# Altium schematic sheet MCU.SchDoc
size A4; SheetNumber: 4; SheetTotal: 4
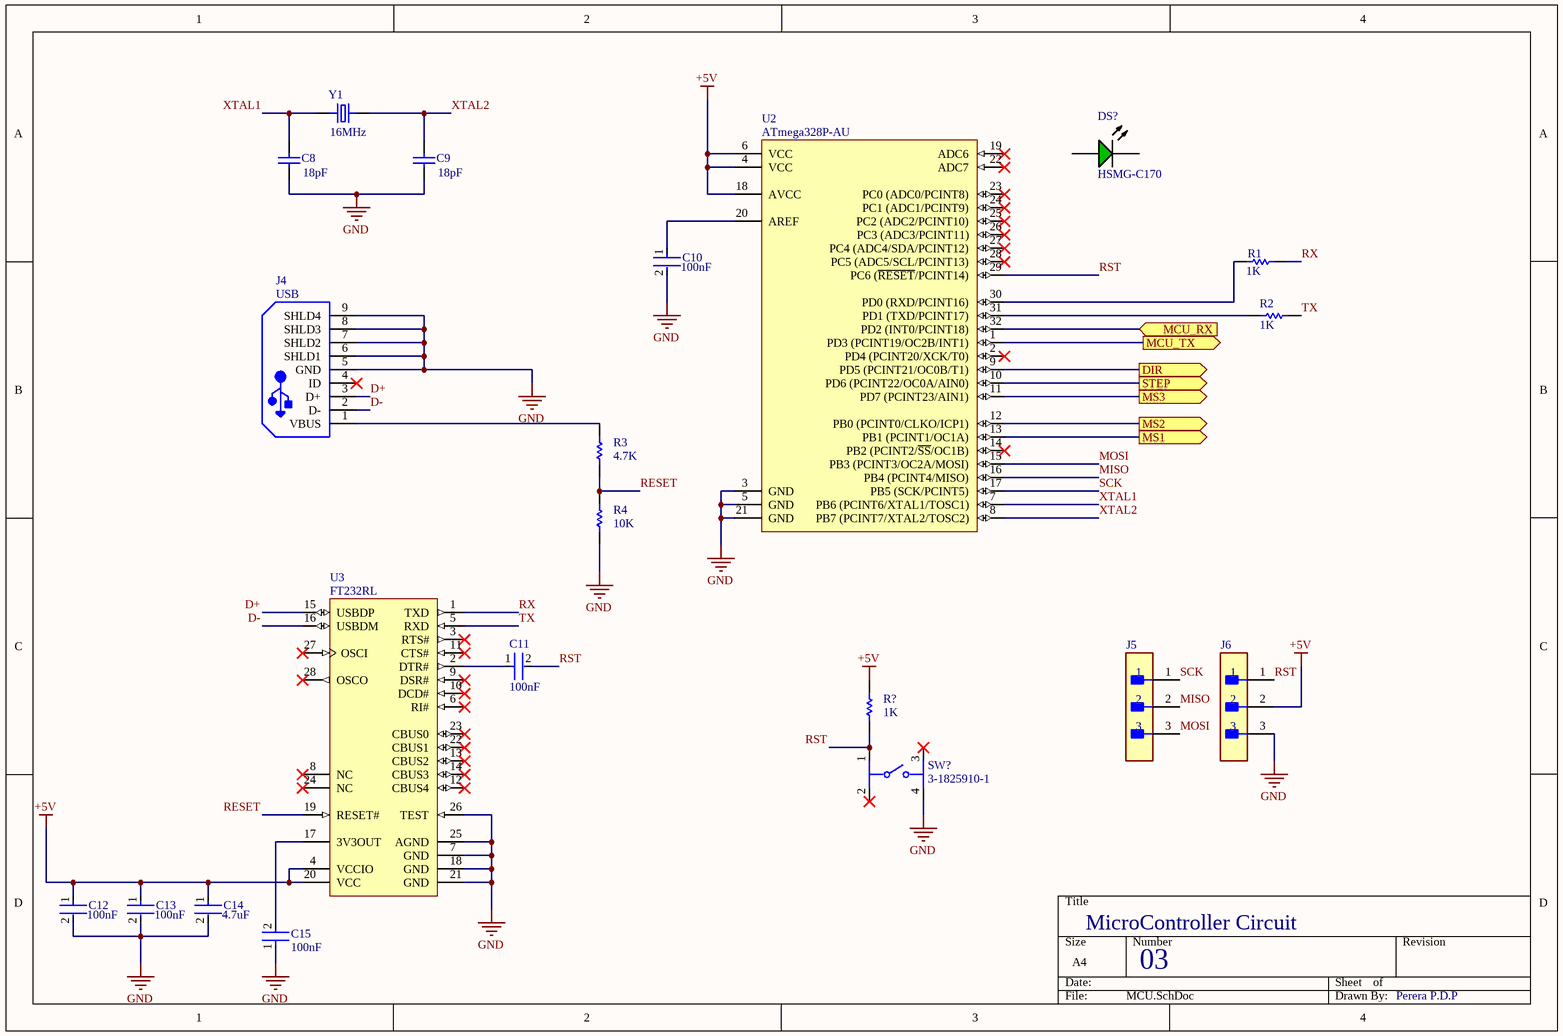
[diagram p0: MCU.SchDoc]

## Parts
C8  value 18pF  [CAPC2013X115X51ML20T26]  (hidden comment: 08052U180GAT2A)
C9  value 18pF  [CAPC2013X115X51ML20T26]  (hidden comment: 08052U180GAT2A)
C10  Capacitance: 100nF  [FP-0805-L_2_01_0_2-W_1_25-IPC_B]  (hidden comment: 08051C104KAT2A)
C11  Capacitance: 100nF  [FP-0805-L_2_01_0_2-W_1_25-IPC_B]  (hidden comment: 08051C104KAT2A)
C12  Capacitance: 100nF  [FP-0805-L_2_01_0_2-W_1_25-IPC_B]  (hidden comment: 08051C104KAT2A)
C13  Capacitance: 100nF  [FP-0805-L_2_01_0_2-W_1_25-IPC_B]  (hidden comment: 08051C104KAT2A)
C14  Capacitance: 4.7uF  [FP-0805-L_2_01_0_2-W_1_25-MFG]  (hidden comment: 0805YC475KAT2A)
C15  Capacitance: 100nF  [FP-0805-L_2_01_0_2-W_1_25-IPC_B]  (hidden comment: 08051C104KAT2A)
DS?  HSMG-C170  [AVAG-HSMX-C170_V]
J4  Model: USB  [MOLX-56579-0576_V]  (hidden comment: 56579-0576)
J5  NRPN031PAEN-RC  [FP-NRPN031PAEN-RC-MFG]  (value not drawn)
J6  NRPN031PAEN-RC  [FP-NRPN031PAEN-RC-MFG]  (value not drawn)
R1  value 1K  [RESC2013X60X35NL10T20]  (hidden comment: RT0805BRD071KL)
R2  value 1K  [RESC2013X60X35NL10T20]  (hidden comment: RT0805BRD071KL)
R3  value 4.7K  [RESC2013X60X40ML20T25]  (hidden comment: ERA6AEB472V)
R4  value 10K  [RESC2013X60X40NL15T20]  (hidden comment: CRCW080510K0FKEAHP)
R?  value 1K  [RESC2013X60X35NL10T20]  (hidden comment: RT0805BRD071KL)
SW?  3-1825910-1  [FP-3-1825910-1-MFG]
U2  ATmega328P-AU  [32A_M]
U3  FT232RL  [FTDI-SSOP-28_M]
Y1  value 16MHz  [XTAL_ECS-160-S-5PX-TR]  (hidden comment: ECS-160-S-5PX-TR)

## Ports
DIR (out, see TOP[2B], Motor_driver[1B]), MCU_RX (in, see TOP[2C]), MCU_TX (out, see TOP[2C]), MS1 (out, see TOP[2B], Motor_driver[1B]), MS2 (out, see TOP[2B], Motor_driver[1B]), MS3 (out, see TOP[2B], Motor_driver[1B]), STEP (out, see TOP[2B], Motor_driver[1B])

## Nets
+5V: C12.1 C13.1 C14.1 J6.2 R?.2 U2.4(VCC) U2.6(VCC) U2.18(AVCC) U3.4(VCCIO) U3.20(VCC)
GND: C8.1 C9.1 C10.2 C12.2 C13.2 C14.2 C15.1 J4.5(GND) J4.6(SHLD1) J4.7(SHLD2) J4.8(SHLD3) J4.9(SHLD4) J6.3 R4.1 SW?.4 U2.3(GND) U2.5(GND) U2.21(GND) U3.7(GND) U3.18(GND) U3.21(GND) U3.25(AGND) U3.26(TEST)
D+: J4.3(D+) U3.15(USBDP)
D-: J4.2(D-) U3.16(USBDM)
DIR: U2.9(PD5_(PCINT21/OC0B/T1)) ; port DIR
MCU_RX: U2.32(PD2_(INT0/PCINT18)) ; port MCU_RX
MCU_TX: U2.1(PD3_(PCINT19/OC2B/INT1)) ; port MCU_TX
MISO: J5.2 U2.16(PB4_(PCINT4/MISO))
MOSI: J5.3 U2.15(PB3_(PCINT3/OC2A/MOSI))
MS1: U2.13(PB1_(PCINT1/OC1A)) ; port MS1
MS2: U2.12(PB0_(PCINT0/CLKO/ICP1)) ; port MS2
MS3: U2.11(PD7_(PCINT23/AIN1)) ; port MS3
RESET: R3.1 R4.2 U3.19(RESET#)
RST: C11.2 J6.1 R?.1 SW?.1 U2.29(PC6_(~{RESET}/PCINT14))
RX: R1.1 U3.1(TXD)
SCK: J5.1 U2.17(PB5_(SCK/PCINT5))
STEP: U2.10(PD6_(PCINT22/OC0A/AIN0)) ; port STEP
TX: R2.1 U3.5(RXD)
XTAL1: C8.2 U2.7(PB6_(PCINT6/XTAL1/TOSC1)) Y1.1
XTAL2: C9.2 U2.8(PB7_(PCINT7/XTAL2/TOSC2)) Y1.2
NetC10_1: C10.1 U2.20(AREF)
NetC11_1: C11.1 U3.2(DTR#)
NetC15_2: C15.2 U3.17(3V3OUT)
NetJ4_1: J4.1(VBUS) R3.2
NetR1_2: R1.2 U2.30(PD0_(RXD/PCINT16))
NetR2_2: R2.2 U2.31(PD1_(TXD/PCINT17))

Not connected (* = marked no-connect by the designer): DS? 1(A) 2(K); J4 4(ID)*; SW? 2* 3*; U2 2(PD4_(PCINT20/XCK/T0))* 14(PB2_(PCINT2/~{SS}/OC1B))* 19(ADC6)* 22(ADC7)* 23(PC0_(ADC0/PCINT8))* 24(PC1_(ADC1/PCINT9))* 25(PC2_(ADC2/PCINT10))* 26(PC3_(ADC3/PCINT11))* 27(PC4_(ADC4/SDA/PCINT12))* 28(PC5_(ADC5/SCL/PCINT13))*; U3 3(RTS#)* 6(RI#)* 8(NC)* 9(DSR#)* 10(DCD#)* 11(CTS#)* 12(CBUS4)* 13(CBUS2)* 14(CBUS3)* 22(CBUS1)* 23(CBUS0)* 24(NC)* 27(OSCI)* 28(OSCO)*

## Notes on the sheet
- MicroController Circuit
- 03
- Perera P.D.P

## Library data of the parts
C8 C9 = CMP-2007-04887-1: Manufacturer: AVX Interconnect / Elco; Part Number: 08052U180GAT2A
C10-C13 C15 = CMP-2007-04174-2: General Purpose Ceramic Capacitor, 0805, 100nF, 10%, X7R, 15%, 100V; Packaging: Tape and Reel; Min Operating Temperature: -55°C; Dielectric Material: Ceramic; Height: 1.4mm; Voltage Rating: 100V; Termination: SMD/SMT; Case Code (Imperial): 0805; Case Code (Metric): 2012; Case/Package: 0805; Construction: Flat; Radiation Hardening: No; Series: -; Dielectric: X7R; Package Quantity: 2000; Mount: Surface Mount; Contact Plating: Tin; Voltage: 100V; Lead Free: Lead Free; Depth: 1.25mm; RoHS Compliant: Yes; Number of Pins: 2; Max Operating Temperature: 125°C; Length: 2.01mm; Voltage Rating (DC): 100V; Thickness: 0.055inch; REACH SVHC: No SVHC; Width: 0.049inch; Tolerance: 10%
C14 = CMP-2007-04518-2: General Purpose Ceramic Capacitor, 0805, 4.7uF, 10%, X7R, 15%, 16V; Dissipation Factor: 3.5%; Voltage: 10V; Height: 1.52mm; Package Quantity: 1; Voltage Rating: 16V; RoHS Compliant: Yes; Mount: Surface Mount; REACH SVHC: No SVHC; Number of Pins: 2; Packaging: Tape and Reel; Radiation Hardening: No; Thickness: 0.06inch; Width: 0.049inch; Length: 2.01mm; Termination: SMD/SMT; Case Code (Metric): 2012; Max Operating Temperature: 125°C; Construction: Flat; Series: -; Depth: 1.25mm; Voltage Rating (DC): 16V; Dielectric: X7R; Contact Plating: Tin; Tolerance: 10%; Lead Free: Lead Free; Min Operating Temperature: -55°C; Case Code (Imperial): 0805; Case/Package: 0805; Value: *
DS? = CMP-2000-05062-1: Chip LED, Green, 2.2 V, -40 to 85 degC, 2-Pin SMD, Pb-Free, Tape and Reel; Manufacturer: Avago; No. of Pins: 2; Peak Wavelength: 570nm; SVHC: NoSVHC(16-Jun-2014); Dominant Wavelength: 572nm; Forward Current If: 20mA; Viewing Angle: 170deg; Lens Shape: Rectangular; PIV Max: 5V; External Width: 1.25mm; LED Type: Standard; External Depth: 0.8mm; Opto Mounting Orientation: Top; Luminous Intensity: 15mcd; Luminous Intensity Min: 4mcd; Forward Voltage VF Max: 2.6V; External Length / Height: 2mm; Bulb Size: 1.25mmx1.4mm; Light Area Height: 1mm; Voltage Vf Typ: 2.2V; Operating Temperature Max: 85degC; Datasheet Version: Oct-08; MSL: MSL2A-4weeks; Peak Forward Current: 20mA; Package Description: 2-Pin Surface Mount Device, Body 2 x 1.25 mm, Height 0.8 mm; Datasheet URL: https://datasheet.ciiva.com/29280/180495-da-01-en-chip-led-hsmg-c170-gelb-gruen-29280971.pdf; Storage Temperature Min: -40degC; LED Colour: Green; Wavelength Typ: 570nm; Mounting Type: SMD; Forward Current If Max: 20mA; Dominant Wavelength Typ: 572nm; LED Mounting: SMD; Operating Temperature Range: -30degCto+85degC; Operating Temperature Min: -30degC; Manufacturer URL: http://www.avagotech.com/; Packaging: CutTape; Luminous Intensity Typ: 15mcd; Package Reference: HSMX-C170; Storage Temperature Max: 85degC; Opto Case Style: SMD; Forward Voltage: 2.2V
J4 = CMP-2000-05643-1: USB Connector, 30 V, 1 A, 0 to 50 degC, 5-Pin SMD, RoHS, Tape and Reel; Brand: Molex; Insulation Resistance: 100MOhms; Connector Type: MiniUSBTypeABReceptacle; Mounting Angle: Right; Number of Ports: 1Port; Gender: Female; Voltage Rating: 30VAC/DC; Number of Contacts: 5Contact; Current Rating: 1A; Package Reference: 56579-0576; Package Description: 5-Pin Surface Mount Device, Body 9.9 x 9 mm, Pitch 0.8 mm; Color: Gray; Manufacturer URL: http://www.molex.com/; Product: MiniUSBTypeABConnectors; Factory Pack Quantity: 800; Standard: USB; Termination Style: SolderTab; Contact Plating: Gold; Product Category: USBConnectors; Datasheet Version: Rev. E, 04/2006; Operating Temperature Range: 0Cto+50C; RoHS: Details; Manufacturer: Molex; Features: MetalshieldingforESDprotection; Mounting Technology: SurfaceMount; Flammability Rating: UL94V-0; Datasheet URL: http://www.molex.com/pdm_docs/sd/565790576_sd.pdf; Series: 56579; Contact Material: CopperAlloy; Packaging: Reel
J5 J6 = CMP-25680-000021-1: CONN HEADER VERT 3POS 2MM; Manufacturer: Sullins; Number Of Contacts: 3; Conn Orientation: Straight; Voltage Rating: 150V; Conn Gender: Male; Current Rating: 2A; Temperature Range High: +105°C; Category: Conn; Manufacturer Part Number: NRPN031PAEN-RC; RoHS: TRUE; Contact Material: Gold,Nickel; ComponentLink2URL: https://drawings-pdf.s3.amazonaws.com/10531.pdf; Temperature: -40°C to +105°C; Lead Free: Yes; Octopart: https://octopart.com/nrpn031paen-rc-sullins-12817732; ComponentLink2Description: Datasheet; Pitch: 2mm; Number Of Rows: 1; Automotive: No; Height: 6mm; Device Class L2: Headers and Wire Housings; Digikey Description: CONN HEADER VERT 3POS 2MM; Package: 0; Device Class L3: unset; Temperature Range Low: -40°C; Device Class L1: Connectors
R1 R2 R? = CMP-2001-01453-1: Manufacturer: Yageo; Part Number: RT0805BRD071KL
R3 = CMP-2001-00644-1: Manufacturer: Panasonic; Part Number: ERA6AEB472V
R4 = CMP-2001-04472-1: Manufacturer: Vishay Dale; Part Number: CRCW080510K0FKEAHP
SW? = CMP-03407-000001-1: SWITCH TACTILE SPST-NO 0.05A 24V; Manufacturer: TE Connectivity; Operating Force: 160gf; Contact Current Rating: 50mA; Description: Switch Tactile OFF (ON) SPST Round Button PC Pins 0.05A 24VDC 100000Cycles 1.57N Thru-Hole; Contact Resistance: 100mΩ; Electromechanical Life: 100000Cycles; Device Class L1: Electromechanical; ComponentLink2URL: https://www.te.com/commerce/DocumentDelivery/DDEController?Action=srchrtrv&DocNm=1825910&DocType=Customer+Drawing&DocLang=English; Category: Switch; Device Class L2: Switches; Temperature: -35°C to +85°C; RoHS: TRUE; Mount: Through Hole; Manufacturer Part Number: 3-1825910-1; Automotive: No; Lead Free: Yes; Device Class L3: Tactile Switches; ComponentLink2Description: Datasheet; Temperature Range High: +85°C; Height: 17.3mm; Package: 0; Temperature Range Low: -35°C; Throw Configuration: SPST-NO; Digikey Description: SWITCH TACTILE SPST-NO 0.05A 24V; Octopart: https://octopart.com/3-1825910-1-te+connectivity-46506874
U2 = CMP-0095-00269-2: 8-bit AVR Microcontroller, 32KB Flash, 1KB EEPROM, 2KB SRAM, 32-pin TQFP, Industrial Grade (-40°C to 85°C); PackageDescription: 32-Lead, 7x7x1.0 mm Body, 0.8mm Lead Pitch, Thin Profile Plastic Quad Flat Package (TQFP); DatasheetVersion: revD, May-2011; RevisionNote: DatasheetVersion & PackageVersion updated. URLs added.; ComponentLink1URL: http://www.atmel.com/; ComponentLink2Description: ATmega48A/48PA/88A/88PA/168A/168PA/328/328P Datasheet; Code_JEDEC: MS-026-ABA; ComponentLink1Description: Manufacturer URL; PackageReference: 32A; ComponentLink3Description: ATmega48A/48PA/88A/88PA/168A/168PA/328/328P Summary; ComponentLink2URL: http://www.atmel.com/dyn/resources/prod_documents/doc8271.pdf; PackageVersion: revC, Oct-2010; ComponentLink3URL: http://www.atmel.com/dyn/resources/prod_documents/8271S.pdf
U3 = CMP-2000-05029-1: IC USB FS SERIAL UART 28-SSOP; Manufacturer: FTDI; Receive FIFO: 256B; Number of Channels per Chip: 1; Maximum Data Rate: 3MBd; Transmit FIFO: 128B; Dimensions: 10.2x5.3x1.75mm; Mounting Type: SurfaceMount; Height: 1.75mm; Package Type: SSOP; Datasheet Version: Rev. 1.04, 02/2006; Width: 5.3mm; Manufacturer URL: http://www.ftdichip.com/; Datasheet URL: http://datasheet.octopart.com/FT232RL-FTDI-datasheet-120501.pdf; Maximum Operating Temperature: +85degC; Minimum Operating Temperature: -40degC; Pin Count: 28; Length: 10.2mm
Y1 = ECS-160-S-5PX-TR: 16MHz Â±30ppm Crystal Series 40 Ohms HC-49/US; MF: ECS Inc.; MP: ECS-160-S-5PX-TR; Package: HC49/US ECS International; Price: None; Availability: Unavailable; SnapEDA_Link: https://www.snapeda.com/parts/ECS-160-S-5PX-TR/ECS%20Inc./view-part/2457269/?ref=snap; Parameter 1: *